# Altium schematic sheet Power&CH340G.SchDoc
size A4
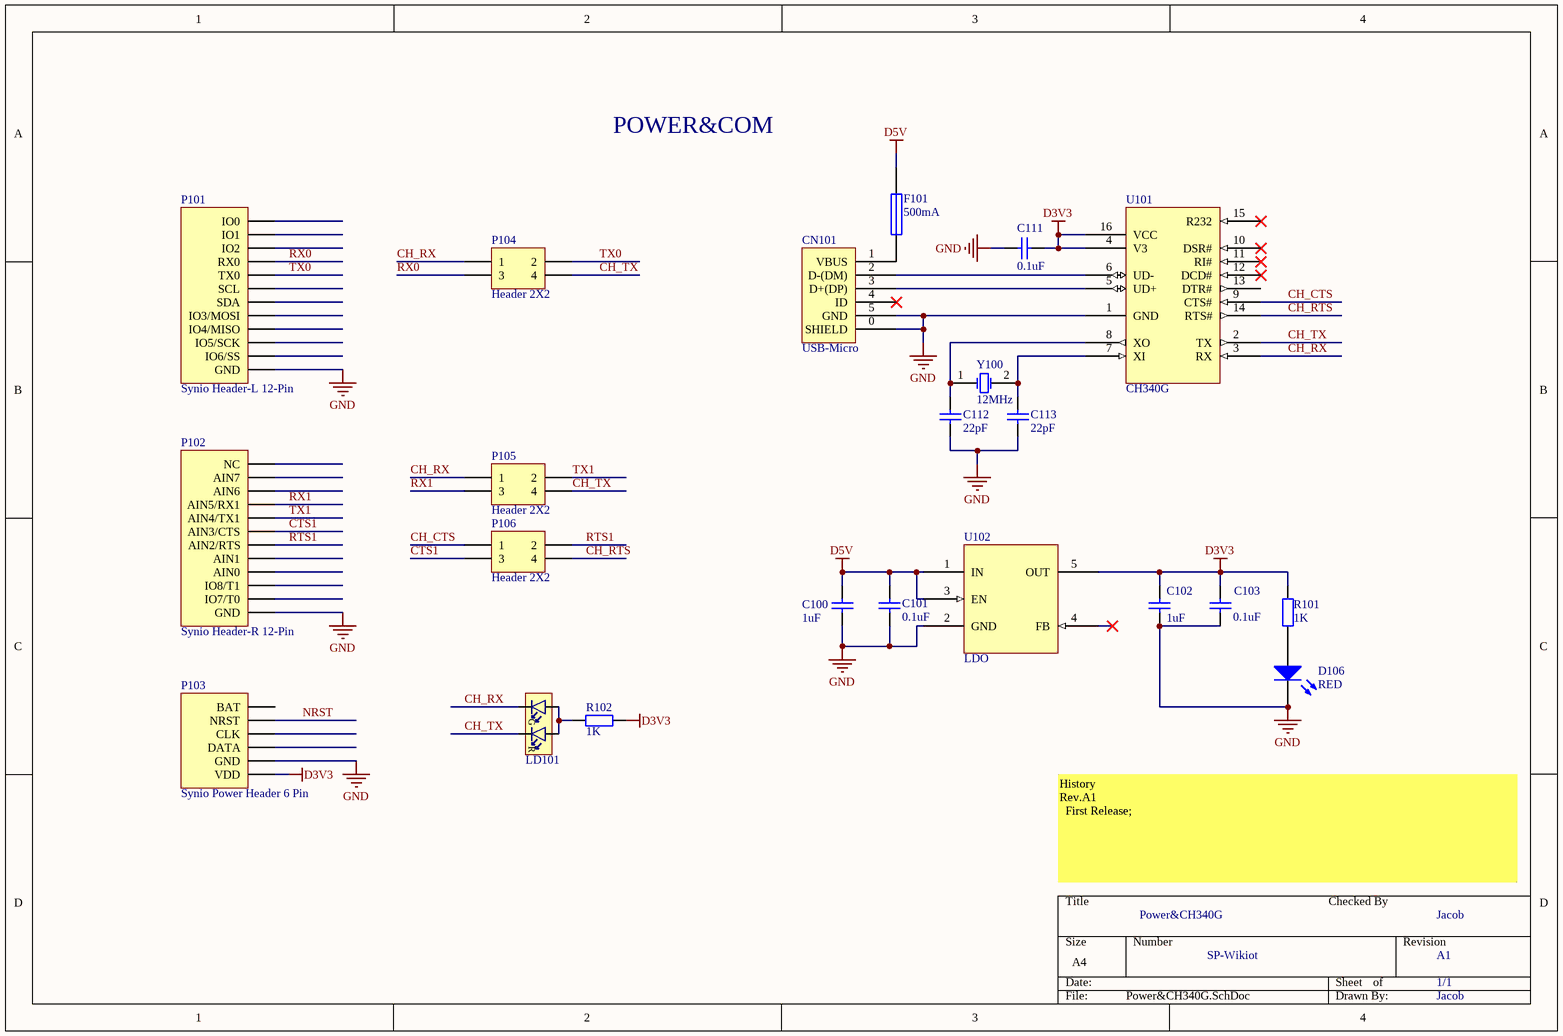
[diagram p0: Power&CH340G.SchDoc]

## Parts
C100  1uF  [0603M]
C101  0.1uF  [0603M]
C102  1uF  [0603M]
C103  0.1uF  [0603M]
C111  0.1uF  [0603M]
C112  22pF  [0603M]
C113  22pF  [0603M]
CN101  USB-Micro  [USB-MICRO-Female-Lite]
D106  RED  [0603pn]
F101  500mA  [0805]
LD101  LTST-C195KGJRKT  [0805-LED-Bi]  (value not drawn)
P101  Synio Header-L 12-Pin  [HDR1X12]
P102  Synio Header-R 12-Pin  [HDR1X12]
P103  Synio Power Header 6 Pin  [HDR1X6/2.54MM]
P104  Header 2X2  [HDR2X2/2.54MM]
P105  Header 2X2  [HDR2X2/2.54MM]
P106  Header 2X2  [HDR2X2/2.54MM]
R101  1K  [0603M]
R102  1K  [0603M]
U101  CH340G  [SO16_M]
U102  LDO  [SOT23-5]
Y100  12MHz  [XTAL_49S]

## Nets
D3V3: C102.2 C103.2 C111.2 P103.1(VDD) R101.2 R102.1 U101.4(V3) U101.16(VCC) U102.5(OUT)
D5V: C100.2 C101.2 F101.1 U102.1(IN) U102.3(EN)
GND: C100.1 C101.1 C102.1 C103.1 C111.1 C112.1 C113.1 CN101.0(SHIELD) CN101.5(GND) D106.2(K) P101.1(GND) P102.1(GND) P103.2(GND) U101.1(GND) U102.2(GND)
CH_CTS: P106.1 U101.9(CTS#)
CH_RTS: P106.4 U101.14(RTS#)
CH_RX: LD101.1(C1) P104.1 P105.1 U101.3(RX)
CH_TX: LD101.2(C2) P104.4 P105.4 U101.2(TX)
CTS1: P102.7(AIN3/CTS) P106.3
NRST: P103.5(NRST)
RTS1: P102.6(AIN2/RTS) P106.2
RX0: P101.9(RX0) P104.3
RX1: P102.9(AIN5/RX1) P105.3
TX0: P101.8(TX0) P104.2
TX1: P102.8(AIN4/TX1) P105.2
NetC112_2: C112.2 U101.8(XO) Y100.1(OSC1)
NetC113_2: C113.2 U101.7(XI) Y100.2(OSC2)
NetCN101_1: CN101.1(VBUS) F101.2
NetCN101_2: CN101.2(D-(DM)) U101.6(UD-)
NetCN101_3: CN101.3(D+(DP)) U101.5(UD+)
NetD106_1: D106.1(A) R101.1
NetLD101_3: LD101.3(A2) LD101.4(A1) R102.2

Not connected (* = marked no-connect by the designer): CN101 4(ID)*; P101 2(IO6/SS) 3(IO5/SCK) 4(IO4/MISO) 5(IO3/MOSI) 6(SDA) 7(SCL) 10(IO2) 11(IO1) 12(IO0); P102 2(IO7/T0) 3(IO8/T1) 4(AIN0) 5(AIN1) 10(AIN6) 11(AIN7) 12(NC); P103 3(DATA) 4(CLK) 6(BAT); U101 10(DSR#)* 11(RI#)* 12(DCD#)* 13(DTR#) 15(R232)*; U102 4(FB)*

## Notes on the sheet
- POWER&COM
- History
  Rev.A1
  First Release;
- Power&CH340G
- Checked By
- Jacob
- SP-Wikiot
- A1
- 1/1
- (in symbol LED-DUAL) G; R

## Library data of the parts
C100-C103 C111-C113 = Cap: Capacitor; Published: 8-Jun-2000; LatestRevisionDate: 17-Jul-2002; LatestRevisionNote: Re-released for DXP Platform.; PackageReference: RAD-0.3
  C100 C102: Value: 1uF
  C101 C103 C111: Value: 0.1uF
  C112 C113: Publisher: Altium Limited; Value: 22pF
D106 = LED0: Typical INFRARED GaAs LED; Published: 8-Jun-2000; LatestRevisionDate: 08-Jul-2005; LatestRevisionNote: Mech Layer 1 removed.; PackageReference: LED-0; Publisher: Altium Limited
F101 = Fuse 1: Fuse; Published: 8-Jun-2000; LatestRevisionDate: 17-Jul-2002; LatestRevisionNote: Re-released for DXP Platform.; PackageReference: PIN-W2/E2.8; Publisher: Altium Limited; PackageDescription: Thru-Hole; 2 Leads
LD101 = LED-DUAL: Avago, HSMF-A203 Bi-Color LED; Manufacturer: Lite-On Inc; 2nd source part number: 859-LTST-C195KGJRKT; Note: HSMF-A203- xxxxx GaP Red GaP Emerald Green; Artikkelnr Noca: 13019145; Part Number: LTST-C195KGJRKT; Manufacturer Part Number: LTST-C195KGJRKT; Datasheet: http://media.digikey.com/pdf/Data%20Sheets/Lite-On%20PDFs/LTST-C195KGJRKT.pdf; Footprint: LED_DUAL_0606; LatestRevisionDate: 2012-07-05; Pin Count: 4; Publisher: Nordic Semiconductor; Published: 2012-07-05; Value: LTST-C195KGJRKT; Supplier: Digi-Key; Supplier part number: 160-1452-1-ND; 2nd source Supplier: Mouser
P101 = Synio Header-L 12-Pin: Synio Header-L, 12-Pin; LatestRevisionDate: 17-Jul-2002; LatestRevisionNote: Re-released for DXP Platform.; Publisher: Altium Limited
P102 = Synio Header-R 12-Pin: Synio Header-R, 12-Pin; LatestRevisionDate: 17-Jul-2002; LatestRevisionNote: Re-released for DXP Platform.; Publisher: Altium Limited
P104-P106 = Header 2X2: Header, 2-Pin, Dual row; LatestRevisionDate: 17-Jul-2002; LatestRevisionNote: Re-released for DXP Platform.; Publisher: Altium Limited
R101 R102 = Res2: Resistor; Published: 8-Jun-2000; LatestRevisionDate: 17-Jul-2002; LatestRevisionNote: Re-released for DXP Platform.; PackageReference: AXIAL-0.4; Publisher: Altium Limited; Value: 1K
U101 = CH340G: USB to UART IC
U102 = LDO-SOT23-5: General LDO SOT23-5
Y100 = XTAL: Crystal Oscillator; Published: 8-Jun-2000; LatestRevisionDate: 17-Jul-2002; LatestRevisionNote: Re-released for DXP Platform.; PackageReference: R38; Publisher: Altium Limited